# Altium schematic sheet First32.SchDoc
size A4; SheetNumber: 1; SheetTotal: 1
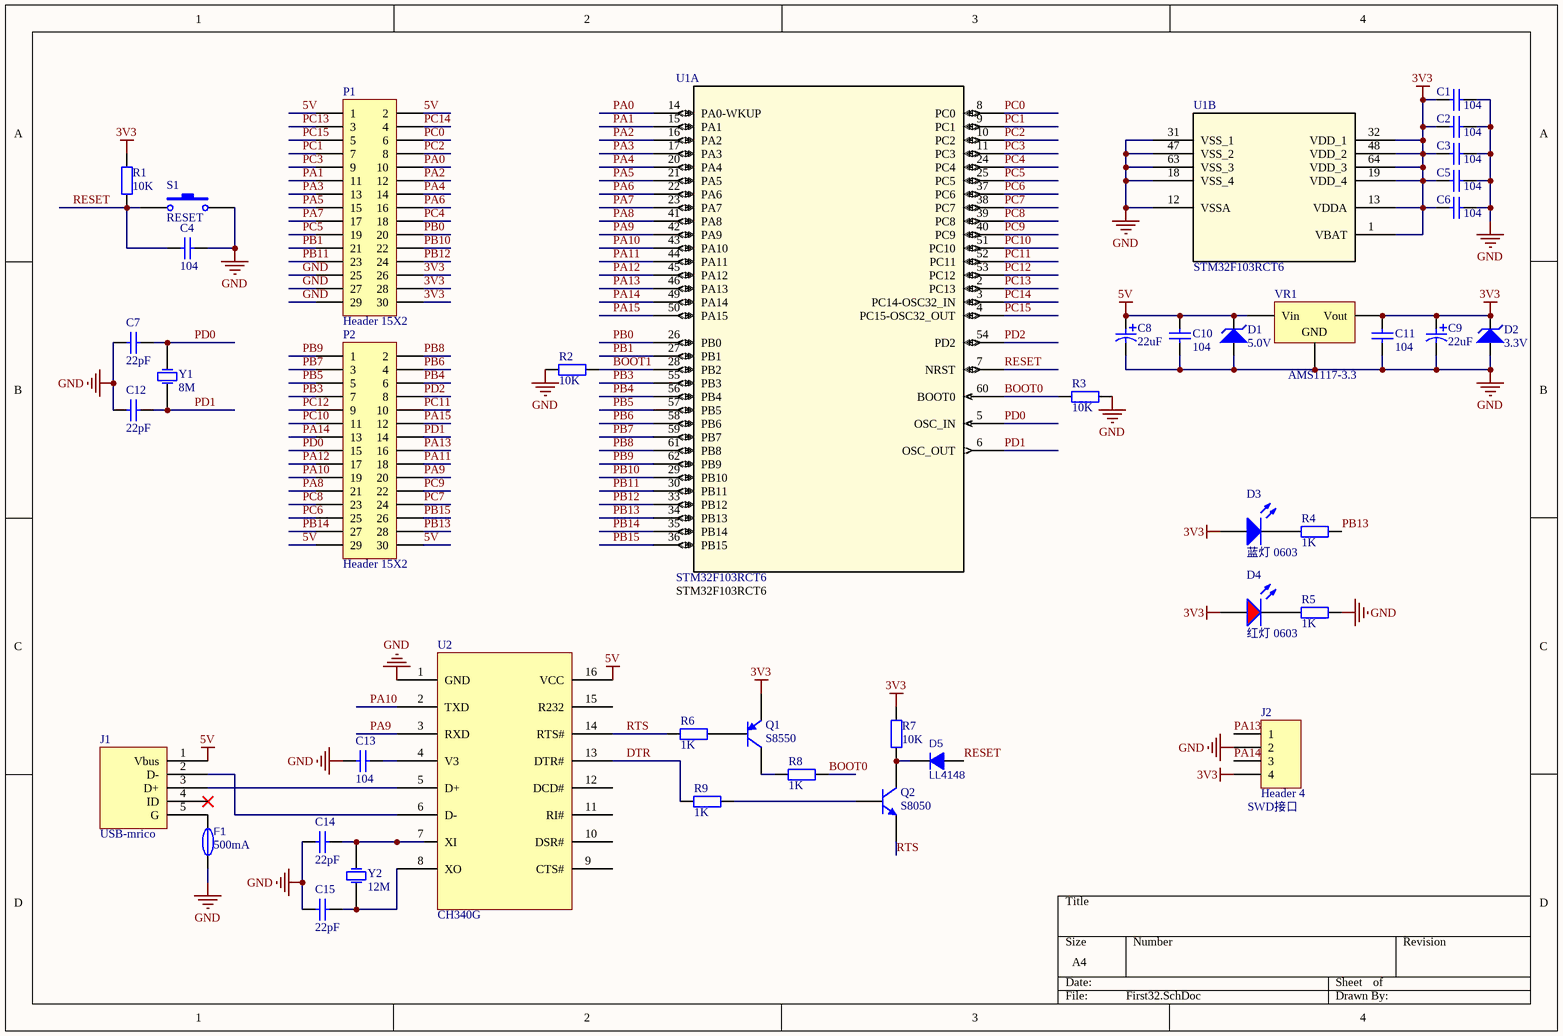
[diagram p0: First32.SchDoc]

## Parts
C1  value 104  [0603_C]  (hidden comment: 100nF (104) 10% 50V)
C2  value 104  [0603_C]  (hidden comment: 100nF (104) 10% 50V)
C3  value 104  [0603_C]  (hidden comment: 100nF (104) 10% 50V)
C4  value 104  [0603_C]  (hidden comment: 100nF (104) 10% 50V)
C5  value 104  [0603_C]  (hidden comment: 100nF (104) 10% 50V)
C6  value 104  [0603_C]  (hidden comment: 100nF (104) 10% 50V)
C7  value 22pF  [0603_C]  (hidden comment: 22pF (220) 5% 50V)
C8  value 22uF  [CASE-B_3528]  (hidden comment: 22uF(226) 10% 16V)
C9  value 22uF  [CASE-B_3528]  (hidden comment: 22uF(226) 10% 16V)
C10  value 104  [0603_C]  (hidden comment: 100nF (104) 10% 50V)
C11  value 104  [0603_C]  (hidden comment: 100nF (104) 10% 50V)
C12  value 22pF  [0603_C]  (hidden comment: 22pF (220) 5% 50V)
C13  value 104  [0603_C]  (hidden comment: 100nF (104) 10% 50V)
C14  value 22pF  [0603_C]  (hidden comment: 22pF (220) 5% 50V)
C15  value 22pF  [0603_C]  (hidden comment: 22pF (220) 5% 50V)
D1  value 5.0V  [SOD-123]  (hidden comment: 5V)
D2  value 3.3V  [SOD-123]  (hidden comment: 5V)
D3  蓝灯 0603  [0603_LED]
D4  红灯 0603  [0603_LED]
D5  LL4148  [LL-34]
F1  value 500mA  [0805_F]  (hidden comment: TLC-PSMD050)
J1  USB-mrico  [SMD-USB-micro_B]
J2  Header 4  value SWD接口  [HDR 1X4]
P1  Header 15X2  [HDR 2x15 2.54 mm]
P2  Header 15X2  [HDR 2x15 2.54 mm]
Q1  S8550  [SOT-23]
Q2  S8050  [SOT-23]
R1  10K  [0603_R]
R2  10K  [0603_R]
R3  10K  [0603_R]
R4  1K  [0603_R]
R5  1K  [0603_R]
R6  1K  [0603_R]
R7  10K  [0603_R]
R8  1K  [0603_R]
R9  1K  [0603_R]
S1  RESET  [SW-SMD-4*4]
U1  STM32F103RCT6  [LQFP64-10x10mm]  (parts A,B of 2)
U2  CH340G  [SOP-16_150mil]
VR1  AMS1117-3.3  [SOT-223]
Y1  value 8M  [HC-49SMD]  (hidden comment: XTAL)
Y2  value 12M  [HC-49S_L11.4-W4.8]  (hidden comment: XTAL)

## Nets
3V3: C1.1 C2.1 C3.1 C5.1 C6.1 C9.1 C11.1 D2.1(K) D3.A D4.A J2.4 P1.26 P1.28 P1.30 Q1.2(E) R1.2 R7.2 U1.1(VBAT) U1.13(VDDA) U1.19(VDD_4) U1.32(VDD_1) U1.48(VDD_2) U1.64(VDD_3) VR1.2(Vout)
5V: C8.1 C10.1 D1.1(K) J1.1(Vbus) P1.1 P1.2 P2.29 P2.30 U2.16(VCC) VR1.3(Vin)
GND: C1.2 C2.2 C3.2 C4.2 C5.2 C6.2 C7.1 C8.2 C9.2 C10.2 C11.2 C12.1 C13.1 C14.1 C15.1 D1.2(A) D2.2(A) F1.1 J2.2 P1.25 P1.27 P1.29 R2.1 R3.1 R5.2 S1.2 U1.12(VSSA) U1.18(VSS_4) U1.31(VSS_1) U1.47(VSS_2) U1.63(VSS_3) U2.1(GND) VR1.1(GND)
BOOT0: R3.2 R8.2 U1.60(BOOT0)
BOOT1: R2.2 U1.28(PB2)
DTR: R9.1 U2.13(DTR#)
PA0: P1.10 U1.14(PA0-WKUP)
PA1: P1.11 U1.15(PA1)
PA2: P1.12 U1.16(PA2)
PA3: P1.13 U1.17(PA3)
PA4: P1.14 U1.20(PA4)
PA5: P1.15 U1.21(PA5)
PA6: P1.16 U1.22(PA6)
PA7: P1.17 U1.23(PA7)
PA8: P2.21 U1.41(PA8)
PA9: P2.20 U1.42(PA9) U2.3(RXD)
PA10: P2.19 U1.43(PA10) U2.2(TXD)
PA11: P2.18 U1.44(PA11)
PA12: P2.17 U1.45(PA12)
PA13: J2.1 P2.16 U1.46(PA13)
PA14: J2.3 P2.13 U1.49(PA14)
PA15: P2.12 U1.50(PA15)
PB0: P1.20 U1.26(PB0)
PB1: P1.21 U1.27(PB1)
PB3: P2.7 U1.55(PB3)
PB4: P2.6 U1.56(PB4)
PB5: P2.5 U1.57(PB5)
PB6: P2.4 U1.58(PB6)
PB7: P2.3 U1.59(PB7)
PB8: P2.2 U1.61(PB8)
PB9: P2.1 U1.62(PB9)
PB10: P1.22 U1.29(PB10)
PB11: P1.23 U1.30(PB11)
PB12: P1.24 U1.33(PB12)
PB13: P2.28 R4.2 U1.34(PB13)
PB14: P2.27 U1.35(PB14)
PB15: P2.26 U1.36(PB15)
PC0: P1.6 U1.8(PC0)
PC1: P1.7 U1.9(PC1)
PC2: P1.8 U1.10(PC2)
PC3: P1.9 U1.11(PC3)
PC4: P1.18 U1.24(PC4)
PC5: P1.19 U1.25(PC5)
PC6: P2.25 U1.37(PC6)
PC7: P2.24 U1.38(PC7)
PC8: P2.23 U1.39(PC8)
PC9: P2.22 U1.40(PC9)
PC10: P2.11 U1.51(PC10)
PC11: P2.10 U1.52(PC11)
PC12: P2.9 U1.53(PC12)
PC13: P1.3 U1.2(PC13)
PC14: P1.4 U1.3(PC14-OSC32_IN)
PC15: P1.5 U1.4(PC15-OSC32_OUT)
PD0: C7.2 P2.15 U1.5(OSC_IN) Y1.2(OSC2)
PD1: C12.2 P2.14 U1.6(OSC_OUT) Y1.1(OSC1)
PD2: P2.8 U1.54(PD2)
RESET: C4.1 D5.1(A) R1.1 S1.1 U1.7(NRST)
RTS: Q2.2(E) R6.1 U2.14(RTS#)
NetC13_2: C13.2 U2.4(V3)
NetC14_2: C14.2 U2.7(XI) Y2.1(OSC1)
NetC15_2: C15.2 U2.8(XO) Y2.2(OSC2)
NetD3_K: D3.K R4.1
NetD4_K: D4.K R5.1
NetD5_2: D5.2(K) Q2.3(C) R7.1
NetF1_2: F1.2 J1.5(G)
NetJ1_2: J1.2(D-) U2.6(D-)
NetJ1_3: J1.3(D+) U2.5(D+)
NetQ1_1: Q1.1(B) R6.2
NetQ1_3: Q1.3(C) R8.1
NetQ2_1: Q2.1(B) R9.2

Not connected (* = marked no-connect by the designer): J1 4(ID)*; U2 9(CTS#) 10(DSR#) 11(RI#) 12(DCD#) 15(R232)

## Library data of the parts
C1-C6 C10 C11 C13 = 0603 100nF (104) 10% 50V: 贴片电容; ComponentLink1Description: 供应商链接; ComponentLink1URL: http://www.szlcsc.com/product/details_15331.html; Package: 0603; Supplier: LC; SuppliersPartNumber: C14663
C7 C12 C14 C15 = 0603 22pF (220) 5% 50V: 贴片电容; ComponentLink1Description: 供应商链接; ComponentLink1URL: http://www.szlcsc.com/product/details_2005.html; Package: 0603; Supplier: LC; SuppliersPartNumber: C1653
C8 C9 = 3528 22uF(226) 10% 16V: 钽电容; Package: Case-B_3528; Supplier: LC; SuppliersPartNumber: C129568; ComponentLink1Description: 供应商链接; ComponentLink1URL: https://item.szlcsc.com/140854.html
D1 D2 = Diode-Zener: 稳压二极管
D3 = 0603 蓝灯: 发光二极管; ComponentLink1Description: 供应商链接; ComponentLink1URL: https://item.szlcsc.com/73153.html; Package: 0603; Supplier: LC; SuppliersPartNumber: C72044
D4 = 0603 红灯: 发光二极管; ComponentLink1Description: 供应商链接; ComponentLink1URL: https://item.szlcsc.com/73153.html; Package: 0603; Supplier: LC; SuppliersPartNumber: C72044
D5 = LL4148: BOM_Manufacturer: SEMTECH; BOM_Supplier: LCSC; BOM_Manufacturer Part: LL4148; BOM_Supplier Part: C9808; BOM_JLCPCB Part Class: Basic Part; spicePre: D; spiceSymbolName: LL4148; ComponentLink1Description: 供应商链接; ComponentLink1URL: https://item.szlcsc.com/10338.html
F1 = Fuse: 保险; BOM_Manufacturer: TLC Electronic; Contributor: LCSC; BOM_Supplier: LCSC; BOM_Supplier Part: C261942; BOM_Manufacturer Part: TLC-PSMD050; BOM_JLCPCB Part Class: Extended Part; spicePre: U; spiceSymbolName: TLC-PSMD050; Package: 0805; ComponentLink1Description: 供应商链接; ComponentLink1URL: https://item.szlcsc.com/253417.html
J1 = Micro_USB_B
J2 = Header 4: Header, 4-Pin; LatestRevisionDate: 17-Jul-2002; LatestRevisionNote: Re-released for DXP Platform.; Publisher: Altium Limited
P1 P2 = Header 15X2: Header, 15-Pin, Dual row; Publisher: Altium Limited; ComponentLink1Description: 供应商链接; ComponentLink1URL: https://item.szlcsc.com/57525.html; Package: Through Hole, 2.54mm; SuppliersPartNumber: C56496
Q1 = S8550: PNP三极管; Package: SOT23; Publisher: Altium Limited; ComponentLink1Description: Manufacturer Link; ComponentLink1URL: https://item.szlcsc.com/774241.html; SuppliersPartNumber: C727136
Q2 = S8050: NPN三极管; ComponentLink1Description: Manufacturer Link; ComponentLink1URL: https://item.szlcsc.com/379088.html; SuppliersPartNumber: C397180; Package: SOT-23
R1-R3 R7 = 0603 10KΩ (1002) 1%: 贴片电阻; ComponentLink1Description: 供应商链接; ComponentLink1URL: http://www.szlcsc.com/product/details_26547.html; Package: 0603; Supplier: LC; SuppliersPartNumber: C25804
R4-R6 R8 R9 = 0603 1KΩ (1K) 1%: 贴片电阻; ComponentLink1Description: 供应商链接; ComponentLink1URL: https://item.szlcsc.com/775304.html; Package: 0603; Supplier: LC; SuppliersPartNumber: C727989
S1 = SW-PB-4P: 4脚按键; PackageReference: 4*4; Publisher: LC; ComponentLink1Description: 供应商链接; ComponentLink1URL: https://item.szlcsc.com/551001.html; SuppliersPartNumber: C530667
U1 = STM32F103RCT6: No Description Available; Built_By: EMA_UL_Team; SourceLibrary: Updates_to_database_2020-10-19; Vendor: STMicroelectronics; Copyright: Copyright (C) 2018 Accelerated Designs. All rights reserved; RefDes: RefDes; Type: DEV; Manufacturer_Part_Number: STM32F103RCT6
VR1 = SOT-223 AMS1117-3.3: 低压差线性稳压(LDO); ComponentLink1Description: 供应商链接; ComponentLink1URL: http://www.szlcsc.com/product/details_6652.html; Package: SOT-223; Supplier: LC; SuppliersPartNumber: C6186
Y1 = XTAL: Crystal Oscillator; Published: 8-Jun-2000; LatestRevisionDate: 17-Jul-2002; LatestRevisionNote: Re-released for DXP Platform.; PackageReference: R38; Publisher: Altium Limited; PackageDescription: Crystal, Thru-Hole; 2 Leads; Body 3.1 x 8.2 mm (Dia.xH)
Y2 = XTAL_12M: Crystal Oscillator; Published: 8-Jun-2000; LatestRevisionDate: 17-Jul-2002; LatestRevisionNote: Re-released for DXP Platform.; PackageReference: R38; Publisher: Altium Limited; PackageDescription: Crystal, Thru-Hole; 2 Leads; Body 3.1 x 8.2 mm (Dia.xH)
U2 = CH340G: Package: SOP-16_150mil; ComponentLink1Description: 供应商链接; ComponentLink1URL: https://item.szlcsc.com/14927.html; SuppliersPartNumber: C14267